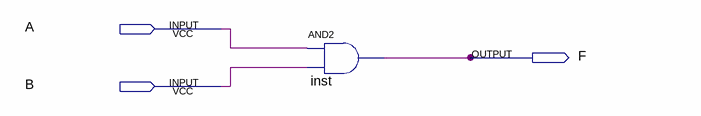
[diagram p0: schematic sheet]
// Quartus schematic Lab5.bdf as structural Verilog: 1 symbols, 3 pins
module Lab5 (
  input  A,
  input  B,
  output F
);

  and inst (F, A, B);
endmodule
